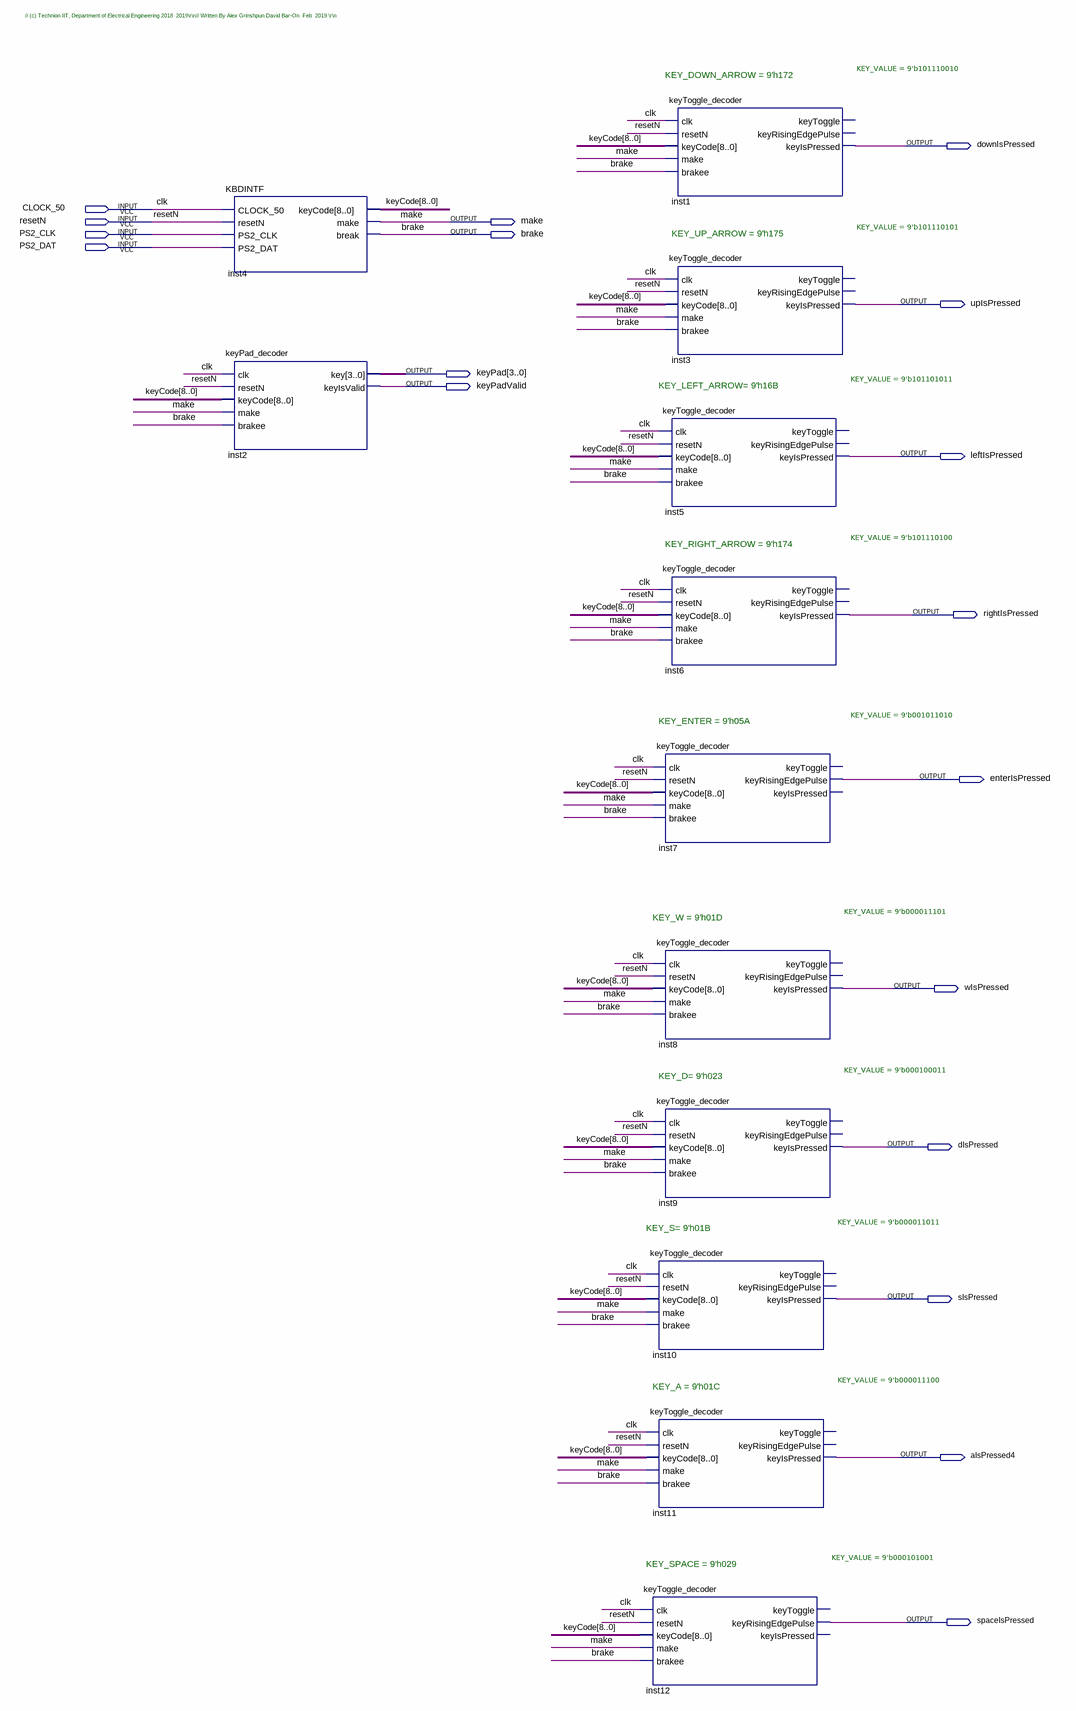
[diagram p0: schematic sheet]
// Quartus schematic TOP_KBD_DEMOALL.bdf as structural Verilog: 12 symbols, 18 pins
module TOP_KBD_DEMOALL (
  input  CLOCK_50,
  input  resetN,
  input  PS2_CLK,
  input  PS2_DAT,
  output downIsPressed,
  output make,
  output brake,
  output upIsPressed,
  output [3:0] keyPad,
  output keyPadValid,
  output leftIsPressed,
  output rightIsPressed,
  output enterIsPressed,
  output wIsPressed,
  output dIsPressed,
  output sIsPressed,
  output aIsPressed4,
  output spaceIsPressed
);

  wire [8:0] keyCode;

  KBDINTF inst4 (
    .CLOCK_50(CLOCK_50), .resetN(resetN), .PS2_CLK(PS2_CLK), .PS2_DAT(PS2_DAT), .keyCode(keyCode),
    .make(make), .\break (brake));
  keyPad_decoder inst2 (
    .clk(CLOCK_50), .resetN(resetN), .keyCode(keyCode), .make(make), .brakee(brake), .key(keyPad),
    .keyIsValid(keyPadValid));
  keyToggle_decoder #(.KEY_VALUE(9'b000101001)) inst12 (
    .clk(CLOCK_50), .resetN(resetN), .keyCode(keyCode), .make(make), .brakee(brake),
    .keyRisingEdgePulse(spaceIsPressed));  // open: keyToggle, keyIsPressed
  keyToggle_decoder #(.KEY_VALUE(9'b101110010)) inst1 (
    .clk(CLOCK_50), .resetN(resetN), .keyCode(keyCode), .make(make), .brakee(brake),
    .keyIsPressed(downIsPressed));  // open: keyToggle, keyRisingEdgePulse
  keyToggle_decoder #(.KEY_VALUE(9'b101110101)) inst3 (
    .clk(CLOCK_50), .resetN(resetN), .keyCode(keyCode), .make(make), .brakee(brake),
    .keyIsPressed(upIsPressed));  // open: keyToggle, keyRisingEdgePulse
  keyToggle_decoder #(.KEY_VALUE(9'b101101011)) inst5 (
    .clk(CLOCK_50), .resetN(resetN), .keyCode(keyCode), .make(make), .brakee(brake),
    .keyIsPressed(leftIsPressed));  // open: keyToggle, keyRisingEdgePulse
  keyToggle_decoder #(.KEY_VALUE(9'b101110100)) inst6 (
    .clk(CLOCK_50), .resetN(resetN), .keyCode(keyCode), .make(make), .brakee(brake),
    .keyIsPressed(rightIsPressed));  // open: keyToggle, keyRisingEdgePulse
  keyToggle_decoder #(.KEY_VALUE(9'b001011010)) inst7 (
    .clk(CLOCK_50), .resetN(resetN), .keyCode(keyCode), .make(make), .brakee(brake),
    .keyRisingEdgePulse(enterIsPressed));  // open: keyToggle, keyIsPressed
  keyToggle_decoder #(.KEY_VALUE(9'b000011101)) inst8 (
    .clk(CLOCK_50), .resetN(resetN), .keyCode(keyCode), .make(make), .brakee(brake), .keyIsPressed(wIsPressed));  // open: keyToggle, keyRisingEdgePulse
  keyToggle_decoder #(.KEY_VALUE(9'b000100011)) inst9 (
    .clk(CLOCK_50), .resetN(resetN), .keyCode(keyCode), .make(make), .brakee(brake), .keyIsPressed(dIsPressed));  // open: keyToggle, keyRisingEdgePulse
  keyToggle_decoder #(.KEY_VALUE(9'b000011011)) inst10 (
    .clk(CLOCK_50), .resetN(resetN), .keyCode(keyCode), .make(make), .brakee(brake), .keyIsPressed(sIsPressed));  // open: keyToggle, keyRisingEdgePulse
  keyToggle_decoder #(.KEY_VALUE(9'b000011100)) inst11 (
    .clk(CLOCK_50), .resetN(resetN), .keyCode(keyCode), .make(make), .brakee(brake),
    .keyIsPressed(aIsPressed4));  // open: keyToggle, keyRisingEdgePulse

  // Other names for the same wires on the sheet: clk = CLOCK_50

  // Notes on the sheet:
  //   // (c) Technion IIT, Department of Electrical Engineering 2018  2019\r\n// Written By Alex Grinshpun David Bar-On  Feb  2019 \r\n
  //   KEY_DOWN_ARROW = 9'h172
  //   KEY_UP_ARROW = 9'h175
  //   KEY_LEFT_ARROW= 9'h16B
  //   KEY_RIGHT_ARROW = 9'h174
  //   KEY_ENTER = 9'h05A
  //   KEY_W = 9'h01D
  //   KEY_D= 9'h023
  //   KEY_S= 9'h01B
  //   KEY_A = 9'h01C
  //   KEY_SPACE = 9'h029
endmodule
